# EAGLE schematic design1 (EAGLE 9.6.2)

## Sheet 1 of 2
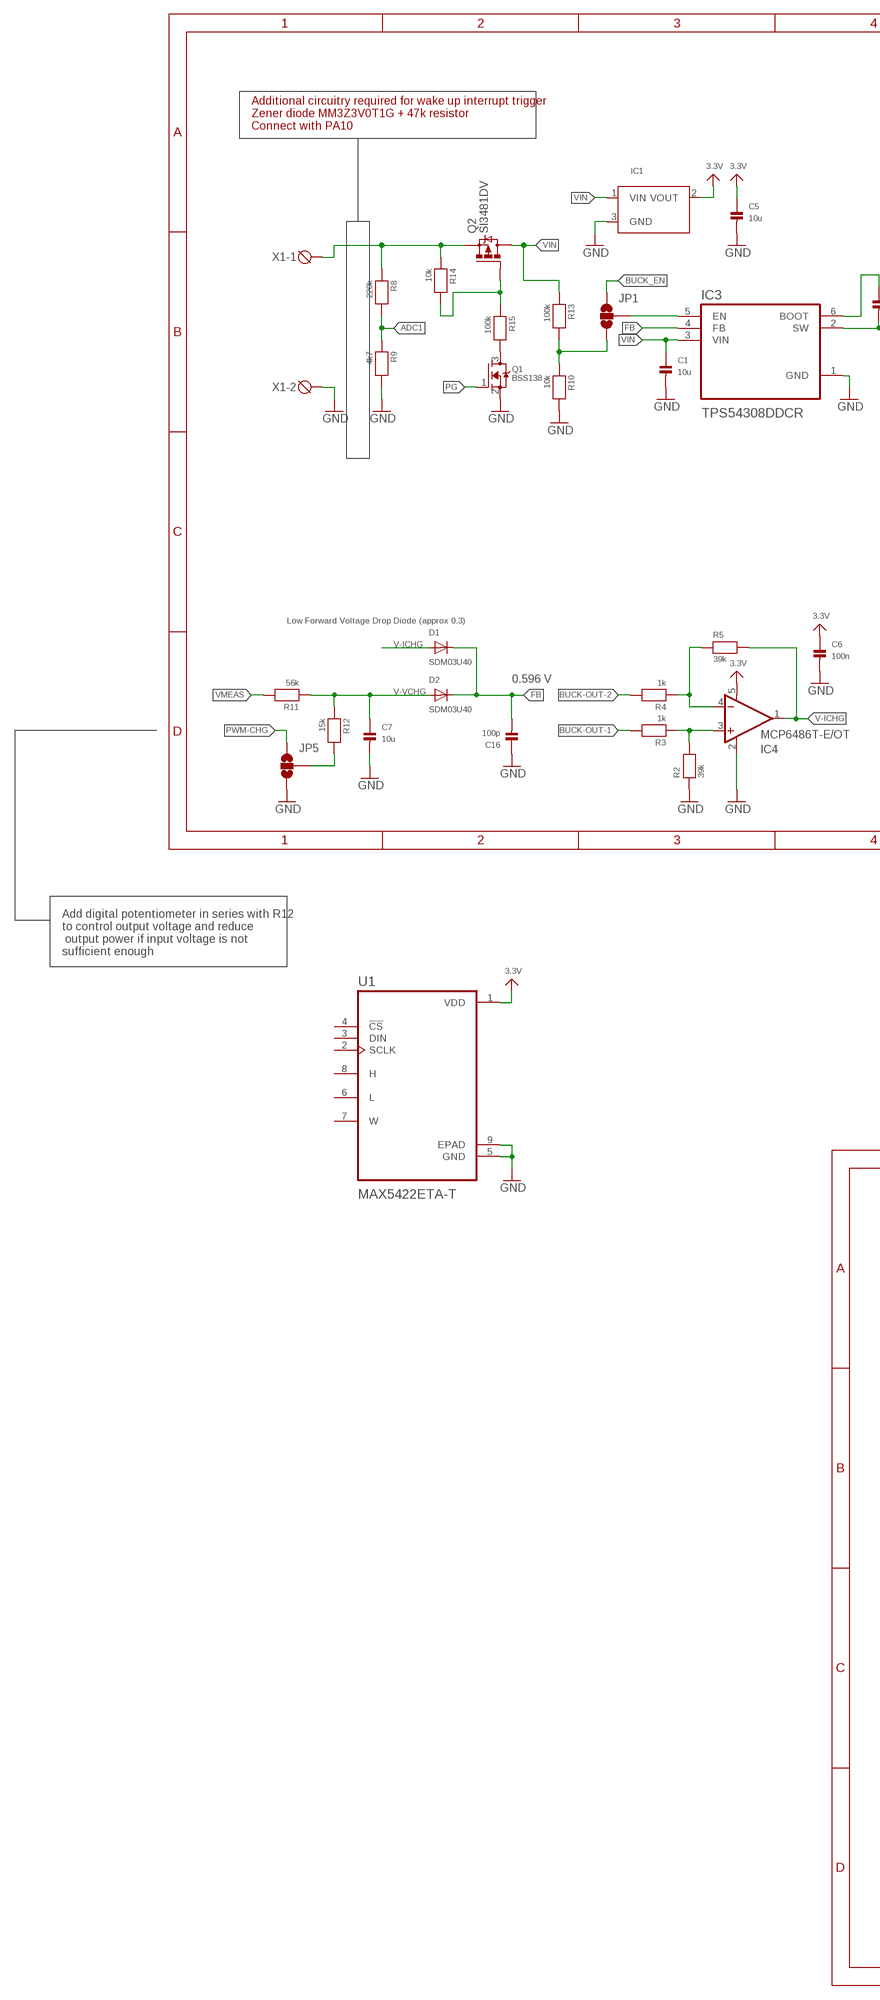
[diagram p0: schematic, sheet 1, part 1 of 2]
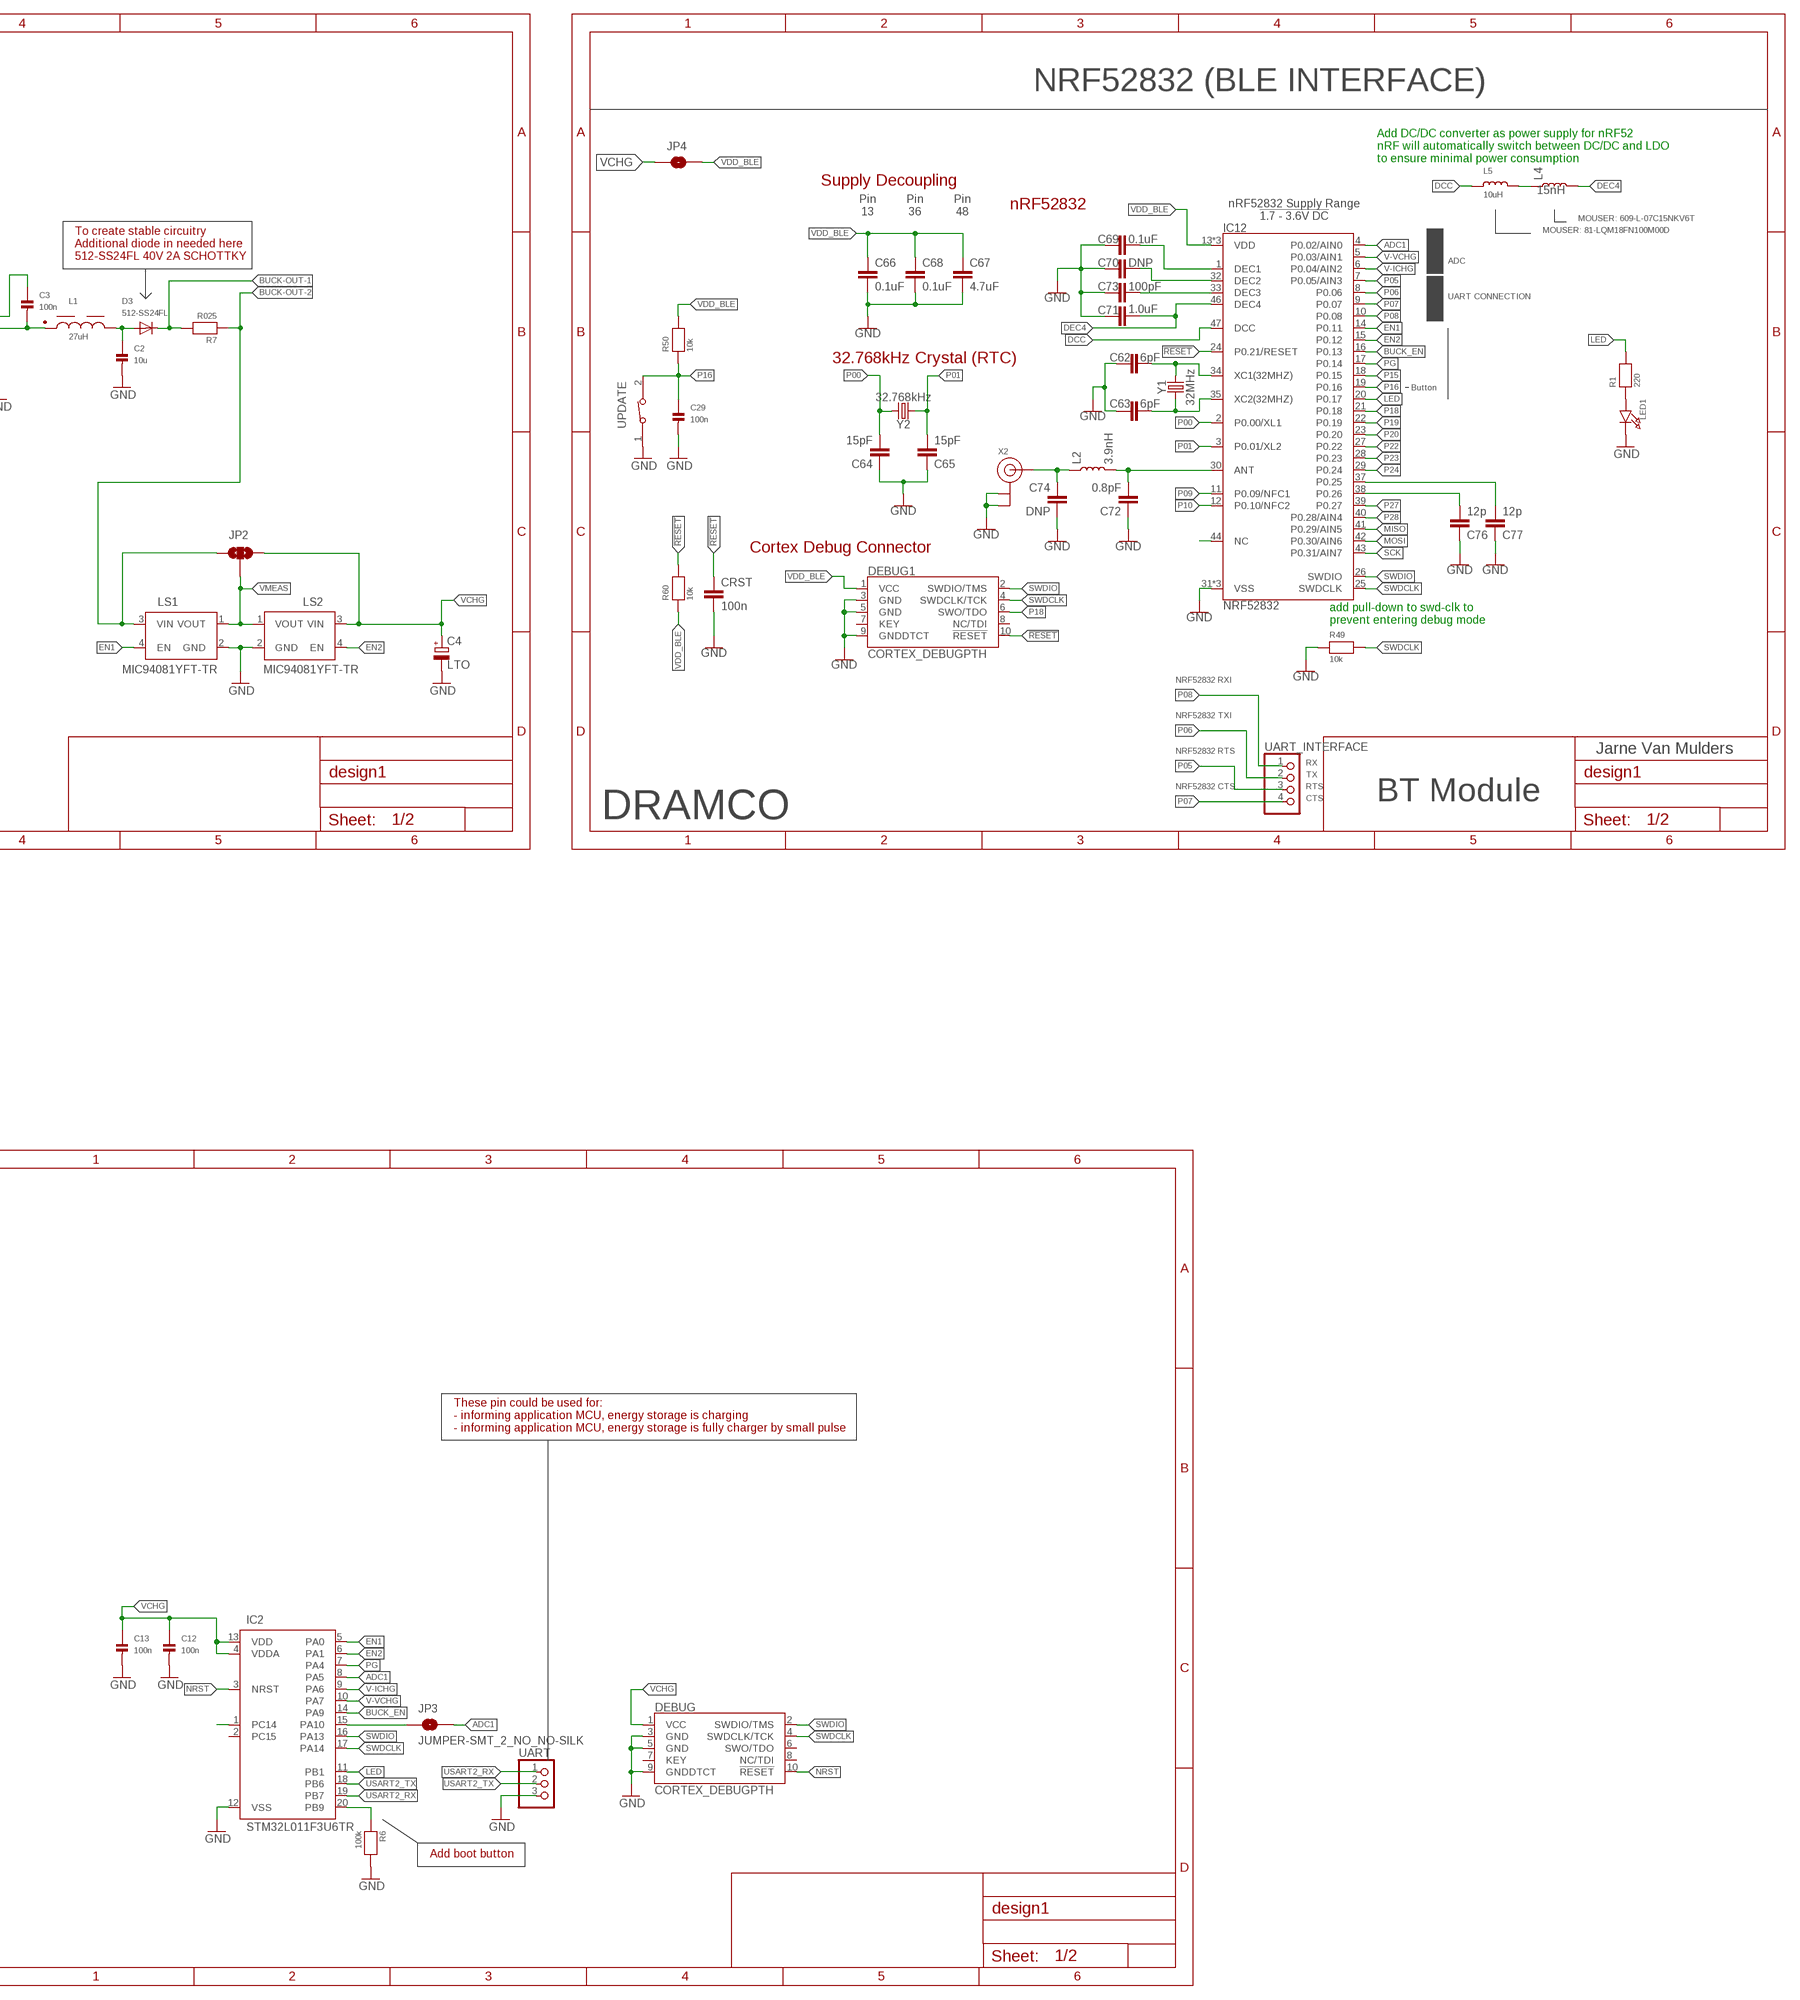
[diagram p1: schematic, sheet 1, part 2 of 2]

### Parts
C1  10u  CAP_CERAMIC0603  [0603]
C2  10u  CAP_CERAMIC0603  [0603]
C3  100n  CAP_CERAMIC0603  [0603]
C4  LTO  CPOL-EUE5-10.5  [E5-10,5]
C5  10u  CAP_CERAMIC0603  [0603]
C6  100n  CAP_CERAMIC0402  [0402]
C7  10u  CAP_CERAMIC0603  [0603]
C12  100n  CAP_CERAMIC0402  [0402]
C13  100n  CAP_CERAMIC0402  [0402]
C16  100p  CAP_CERAMIC0603  [0603]
C29  100n  CAP_CERAMIC0603  [0603]
C62  6pF  6PF-0402-50V-0.5%  [0402]
C63  6pF  6PF-0402-50V-0.5%  [0402]
C64  15pF  15PF-0402-50V-5%  [0402]
C65  15pF  15PF-0402-50V-5%  [0402]
C66  0.1uF  0.1UF-0402-16V-10%  [0402]
C67  4.7uF  4.7UF0603  [0603]
C68  0.1uF  0.1UF-0402-16V-10%  [0402]
C69  0.1uF  0.1UF-0402-16V-10%  [0402]
C70  DNP  CAP0402  [0402]
C71  1.0uF  1.0UF-0402-16V-10%  [0402]
C72  0.8pF  0.8PF-0402-50V-0.1PF  [0402]
C73  100pF  100PF-0402-50V-5%  [0402]
C74  DNP  CAP0402  [0402]
C76  12p  15PF-0402-50V-5%  [0402]
C77  12p  15PF-0402-50V-5%  [0402]
CRST  100n  C-EUC0603  [C0603]
D1  SDM03U40  DIODESOD-523  [SOD-523]
D2  SDM03U40  DIODESOD-523  [SOD-523]
D3  512-SS24FL  DIODESOD-123  [SOD-123]
DEBUG  CORTEX_DEBUGPTH  [2X5-PTH-1.27MM]
DEBUG1  CORTEX_DEBUGPTH  [2X5-PTH-1.27MM]
IC1  VREG_SOT23  [SOT23-R]
IC2  STM32L011F3U6TR  [QFN50P300X300X60-21N]
IC3  TPS54308DDCR  [SOT95P280X110-6N]
IC4  MCP6486T-E/OT  MCP6291T-E/OT  [SOT23-5]
IC12  NRF52832  [QFN48-6X6MM]
JP1  JUMPER-SMT_3_NO_NO-SILK  [SMT-JUMPER_3_NO_NO-SILK]
JP2  JUMPER-SMT_3_NO_NO-SILK  [SMT-JUMPER_3_NO_NO-SILK]
JP3  JUMPER-SMT_2_NO_NO-SILK  [SMT-JUMPER_2_NO_NO-SILK]
JP4  JUMPER-SMT_2_NO_NO-SILK  [SMT-JUMPER_2_NO_NO-SILK]
JP5  JUMPER-SMT_3_NO_NO-SILK  [SMT-JUMPER_3_NO_NO-SILK]
L1  27uH  WE-PD_7332_PLASTIC_7447789127  [WE-PD_7332/7345_PLASTIC_BASE]
L2  3.9nH  INDUCTOR-0402-3.9NH  [0402]
L4  15nH  INDUCTOR-0402-3.9NH  [0402]
L5  10uH  INDUCTOR_0603MP  [_0603MP]
LED1  LED0805  [CHIPLED_0805]
LS1  MIC94081YFT-TR  [IC_MIC94081YFT-TR]
LS2  MIC94081YFT-TR  [IC_MIC94081YFT-TR]
Q1  BSS138  MOSFET-NREFLOW  [SOT23-R]
Q2  SI3481DV  [TSOP-6.PAC]
R1  220  RESISTOR0603  [0603]
R2  39k  RESISTOR0603  [0603]
R3  1k  RESISTOR0603  [0603]
R4  1k  RESISTOR0603  [0603]
R5  39k  RESISTOR0603  [0603]
R6  100k  RESISTOR0603  [0603]
R7  R025  RESISTOR0603  [0603]
R8  220k  RESISTOR0603  [0603]
R9  4k7  RESISTOR0603  [0603]
R10  10k  RESISTOR0603  [0603]
R11  56k  RESISTOR0603  [0603]
R12  15k  RESISTOR0603  [0603]
R13  100k  RESISTOR0603  [0603]
R14  10k  RESISTOR0603  [0603]
R15  100k  RESISTOR0603  [0603]
R49  10k  RESISTOR0603  [0603]
R50  10k  RESISTOR0603  [0603]
R60  10k  RESISTOR0603  [0603]
U1  MAX5422ETA-T  [SON65P300X300X80-9N]
UART  HEADER-1X3ROUND  [1X03_ROUND]
UART_INTERFACE  HEADER-1X4ROUND  [1X04_ROUND]
UPDATE  434111043826  [434111043826]
X1  DG3XX-02-5.0  [DG306-5.0-02P]
X2  ANTENNA_U.FL  [U.FL]
Y1  32MHz  CRYSTAL-32MHZ-SMD-2.0X1.6MM  [CRYSTAL-SMD-2.0X1.6MM]
Y2  32.768kHz  CRYSTAL-32.768KHZSMD-3.2X1.5  [CRYSTAL-SMD-3.2X1.5MM]

### Nets
3.3V: C5.1 C6.1 IC1.2(VOUT) IC4.5(V+) U1.1(VDD)
!RESET!: CRST.1 DEBUG1.10(!RESET) IC12.24(P0.21/RESET) R60.2
ADC1: IC2.8(PA5) IC12.4(P0.02/AIN0) JP3.2 R8.2 R9.1
ANT: C72.2 IC12.30(ANT) L2.2
BUCK-OUT-1: D3.C R3.2 R7.2
BUCK-OUT-2: JP2.1 LS1.3(VIN) R4.2 R7.1
BUCK_EN: IC2.14(PA9) IC12.16(P0.13) JP1.3
DCC: IC12.47(DCC) L5.1
DEC4: C71.2 IC12.46(DEC4) L4.2
DEC5: C69.2 IC12.1(DEC1)
DEC6: C70.2 IC12.32(DEC2)
DEC8: C73.2 IC12.33(DEC3)
EN1: IC2.5(PA0) IC12.14(P0.11) LS1.4(EN)
EN2: IC2.6(PA1) IC12.15(P0.12) LS2.4(EN)
FB: C16.2 D1.K(C) D2.K(C) IC3.4(FB)
GND: C1.2 C2.2 C4.- C5.2 C6.2 C7.2 C12.2 C13.2 C16.1 C29.2 C62.1 C63.2 C64.1 C65.1 C66.2 C67.2 C68.2 C69.1 C70.1 C71.1 C72.1 C73.1 C74.2 C76.1 C77.1 CRST.2 DEBUG1.3(GND) DEBUG1.5(GND) DEBUG1.9(GNDDTCT) DEBUG.3(GND) DEBUG.5(GND) DEBUG.9(GNDDTCT) IC1.3(GND) IC2.12(VSS) IC3.1(GND) IC4.2(V-) IC12.31(VSS) IC12.45(VSS) IC12.EP(VSS) JP5.1 LED1.C LS1.2(GND) LS2.2(GND) Q1.2(S) R2.1 R6.2 R9.2 R10.2 R49.1 U1.5(GND) U1.9(EPAD) UART.3 UPDATE.1 X1.2 X2.1(GND) X2.2(GND)
LED: IC2.11(PB1) IC12.20(P0.17) R1.2
MISO: IC12.41(P0.29/AIN5)
MOSI: IC12.42(P0.30/AIN6)
N$1: JP1.1 R10.1 R13.2
N$2: C3.1 IC3.6(BOOT)
N$3: C3.2 IC3.2(SW) L1.1
N$4: Q1.3(D) R15.2
N$5: Q2.3(G) R14.2 R15.1
N$6: JP5.2 R12.2
N$7: IC3.5(EN) JP1.2
N$8: IC4.4(-IN) R4.1 R5.1
N$9: IC4.3(+IN) R2.2 R3.1
N$10: Q2.4(S) R8.1 R14.1 X1.1
N$11: IC2.15(PA10) JP3.1
N$13: C2.1 D3.A L1.2
N$20: LED1.A R1.1
N$45: C74.1 L2.1 X2.3(SIGNAL)
N$50: C77.2 IC12.37(P0.25)
N$53: L4.1 L5.2
NC: IC12.44(NC)
NRST: DEBUG.10(!RESET) IC2.3(NRST)
P00: C64.2 IC12.2(P0.00/XL1) Y2.P$2
P01: C65.2 IC12.3(P0.01/XL2) Y2.P$1
P05: IC12.7(P0.05/AIN3) UART_INTERFACE.3
P06: IC12.8(P0.06) UART_INTERFACE.2
P07: IC12.9(P0.07) UART_INTERFACE.4
P08: IC12.10(P0.08) UART_INTERFACE.1
P09: IC12.11(P0.09/NFC1)
P10: IC12.12(P0.10/NFC2)
P15: IC12.18(P0.15)
P16: C29.1 IC12.19(P0.16) R50.1 UPDATE.2
P18: DEBUG1.6(SWO/TDO) IC12.21(P0.18)
P19: IC12.22(P0.19)
P20: IC12.23(P0.20)
P22: IC12.27(P0.22)
P23: IC12.28(P0.23)
P24: IC12.29(P0.24)
P26: C76.2 IC12.38(P0.26)
P27: IC12.39(P0.27)
P28: IC12.40(P0.28/AIN4)
PB9: IC2.20(PB9) R6.1
PG: IC2.7(PA4) IC12.17(P0.14) Q1.1(G)
PWM-CHG: JP5.3
SCK: IC12.43(P0.31/AIN7)
SWDCLK: DEBUG1.4(SWDCLK/TCK) DEBUG.4(SWDCLK/TCK) IC2.17(PA14) IC12.25(SWDCLK) R49.2
SWDIO: DEBUG1.2(SWDIO/TMS) DEBUG.2(SWDIO/TMS) IC2.16(PA13) IC12.26(SWDIO)
USART2_RX: IC2.19(PB7) UART.1
USART2_TX: IC2.18(PB6) UART.2
V-ICHG: D1.A IC2.9(PA6) IC4.1(OUT) IC12.6(P0.04/AIN2) R5.2
V-VCHG: C7.1 D2.A IC2.10(PA7) IC12.5(P0.03/AIN1) R11.1 R12.1
VCHG: C4.+ C12.1 C13.1 DEBUG.1(VCC) IC2.4(VDDA) IC2.13(VDD) JP2.3 JP4.1 LS2.3(VIN)
VDD-AUX-EN: IC2.1(PC14)
VDD_BLE: C66.1 C67.1 C68.1 DEBUG1.1(VCC) IC12.13(VDD) IC12.36(VDD) IC12.48(VDD) JP4.2 R50.2 R60.1
VIN: C1.1 IC1.1(VIN) IC3.3(VIN) Q2.1(D) Q2.2(D) Q2.5(D) Q2.6(D) R13.1
VMEAS: JP2.2 LS1.1(VOUT) LS2.1(VOUT) R11.2
XC1: C62.2 IC12.34(XC1(32MHZ)) Y1.3
XC2: C63.1 IC12.35(XC2(32MHZ)) Y1.1
Unconnected: DEBUG1.7(KEY) DEBUG1.8(NC/TDI) DEBUG.6(SWO/TDO) DEBUG.7(KEY) DEBUG.8(NC/TDI) IC2.2(PC15) U1.2(SCLK) U1.3(DIN) U1.4(!CS) U1.6(L) U1.7(W) U1.8(H)

### Notes on the sheet
- NRF52832 (BLE INTERFACE)
- Additional circuitry required for wake up interrupt trigger
  Zener diode MM3Z3V0T1G + 47k resistor
  Connect with PA10
- Add DC/DC converter as power supply for nRF52
  nRF will automatically switch between DC/DC and LDO
  to ensure minimal power consumption
- Supply Decoupling
- nRF52832
- nRF52832 Supply Range
  !1.7 - 3.6V DC!
- Pin
  13
- Pin
  36
- Pin
  48
- MOUSER: 609-L-07C15NKV6T
- MOUSER: 81-LQM18FN100M00D
- To create stable circuitry
  Additional diode in needed here
  512-SS24FL 40V 2A SCHOTTKY
- ADC
- UART CONNECTION
- 32.768kHz Crystal (RTC)
- Button
- Cortex Debug Connector
- Low Forward Voltage Drop Diode (approx 0.3)
- add pull-down to swd-clk to 
  prevent entering debug mode
- 0.596 V | NRF52832 RXI
- NRF52832 TXI
- NRF52832 RTS | Jarne Van Mulders
- RX
- TX
- NRF52832 CTS | RTS
- CTS | BT Module
- DRAMCO
- Add digital potentiometer in series with R12 
  to control output voltage and reduce
   output power if input voltage is not 
  sufficient enough
- These pin could be used for:
  - informing application MCU, energy storage is charging
  - informing application MCU, energy storage is fully charger by small pulse
- Add boot button

## Sheet 2 of 2

## Library data of the parts
C1-C3 C5-C7 C12 C13 C16 C29 = microbuilder:CAP_CERAMIC: Ceramic Capacitors 0402 - 0402 Surface Mount Capacitors 16pF 50V 5% [Digikey: 445-4899-2-ND] 18pF 50V 5% [Digikey: 490-1281-2-ND] 22pF 50V 5% [Digikey: 490-1283-2-ND] 68pF 50V 5% [Digikey: 490-1289-2-ND] 0.1uF 10V 10% [Digikey: 490-1318-2-ND] 1.0uF 6.3V 10% [Digikey: 490-1320-2-ND] 0603 - 0603 Surface Mount Capacitors 16 pF 50V 5% [Digikey: 445-5051-2-ND] 22 pF 50V [Digikey: PCC220ACVTR-ND] 33 pF 50V 5% [Digikey: 490-1415-1-ND] 56pF 50V 5% [Digikey: 490-1421-1-ND] 220pF 50V 5% [Digikey: 445-1285-1-ND] 680 pF 50V 2200 pF 50V 5% C0G [Digikey: 445-1297-1-ND] 5600 pF 100V 5% X7R [Digikey: 478-3711-1-ND] 0.1 µF 25V 10% [Digikey: PCC2277TR-ND] 0.22 µF 16V 10% X7R [Digikey: 445-1318-1-ND] 1.0 µF 25V 10% [Digikey: 445-5146-2-ND] 0603 - RF Specific 3pF 250V +/-0.1pF RF [Digikey: 712-1347-1-ND] 18 pF 250V 5% [Digikey: 478-3505-1-ND or 712-1322-1-ND] 56 pF 250V 5% C0G RF [Digikey: 490-4867-1-ND] 68 pF 250V RF [Digikey: 490-4868-1-ND] 0805 - 0805 Surface Mount Capacitors 220 pF 250V 2% RF Ceramic Capacitor [Digikey: 712-1398-1-ND] 1000 pF 50V 2% NP0 Ceramic Capacitor [Digikey: 478-3760-1-ND] 0.1 µF 25V 10% Ceramic Capacitor [Digikey: PCC1828TR-ND] 1.0 µF 16V 10% Ceramic Capacitor[Digikey: 490-1691-2-ND] 10.0 µF 10V 10% Ceramic Capacitor[Digikey: 709-1228-1-ND] 10.0 uF 16V 10% Ceramic Capacitor [Digikey: 478-5165-2-ND] 47 uF 6.3V 20% Ceramic Capacitor [Digikey: 587-1779-1-ND or 399-5506-1-ND] 1206 - 1206 Surface Mount Capacitors 47uF 10V 20% Ceramic Capacitor [Digikey: 490-5528-1-ND or 399-5508-1-ND or 445-6010-1-ND] 100uF 6.3V -20%, +80% Y5V Ceramic Capacitor (Digikey: 490-4512-1-ND, Mouser: 81-GRM31CF50J107ZE1L)
C4 = rcl:CPOL-EU: POLARIZED CAPACITOR, European symbol
C62 C63 = nrf52832-breakout-temp:6PF: 15pF ceramic capacitors A capacitor is a passive two-terminal electrical component used to store electrical energy temporarily in an electric field.; PROD_ID: CAP-13455
C64 C65 = SparkFun-Capacitors:15PF: 15pF ceramic capacitors A capacitor is a passive two-terminal electrical component used to store electrical energy temporarily in an electric field.; PROD_ID: CAP-13063
C66 C68 C69 = SparkFun-Capacitors:0.1UF: 0.1µF ceramic capacitors A capacitor is a passive two-terminal electrical component used to store electrical energy temporarily in an electric field.; PROD_ID: CAP-12416
C67 = SparkFun-Capacitors:4.7UF: 4.7µF ceramic capacitors A capacitor is a passive two-terminal electrical component used to store electrical energy temporarily in an electric field.; PROD_ID: CAP-08280
C70 C74 = SparkFun-Passives:CAP: Capacitor Standard 0603 ceramic capacitor, and 0.1" leaded capacitor.
C71 = SparkFun-Capacitors:1.0UF: 1µF ceramic capacitors A capacitor is a passive two-terminal electrical component used to store electrical energy temporarily in an electric field.; PROD_ID: CAP-12417
C72 = nrf52832-breakout-temp:0.8PF: 0.8pF ceramic capacitors A capacitor is a passive two-terminal electrical component used to store electrical energy temporarily in an electric field.; PROD_ID: CAP-13456
C73 = nrf52832-breakout-temp:100PF: 100pF/0.1nF ceramic capacitors A capacitor is a passive two-terminal electrical component used to store electrical energy temporarily in an electric field.; PROD_ID: CAP-13458
C76 C77 = SparkFun-Capacitors:15PF: 15pF ceramic capacitors A capacitor is a passive two-terminal electrical component used to store electrical energy temporarily in an electric field.; PROD_ID: CAP-13063; VALUE: 15pF
CRST = rcl:C-EU: CAPACITOR, European symbol; SPICEPREFIX: C
D1-D3 = microbuilder:DIODE: Diode SMA Model Volts Amps Type Vf Vr Digikey # Notes SSA34-E3 40V 3A Schottky 480mV @ 3A 200uA @ 40V SSA34-E3/61TGITR-ND CDBA120-G 20V 1A Schottky 500mV @ 1A 500uA @ 20V 641-1014-6-ND REEL MBRA210 10V 2A Schottky 350mV @ 2A 700uA @ 10V MBRA210LT3 SOD-123 Model Volts Amps Type Vf Vr Order # Notes BAT54T1G 30V 200mA Schottky 800mV @ 200mA 2uA @ 25V BAT54T1GOSTR-ND B0530W 30V 500mA Schottky 430mV @ 500mA 130uA @ 30V B0530W-FDICT-ND REEL MBR120 1A 20V Schottky 340mV @ 1A MBR120VLSFT1GOSCT-ND SOD-323 Model Volts Amps Type Vf Vr Order # Notes PMEG2005EJ 20V 500mA Schottky 355mV @ 500mA 568-4110-1-ND ZLLS410 10V 570mA Schottky 380mV @ 570mA ZLLS410CT-ND 1N4148WS 75V 150mA Silicon/Simple 1V 1N4148WSFSCT-ND REEL SOD-523 Model Volts Amps Type Vf Vr Order # Notes BAT54XV2 30V 200mA Schottky 0.8V @ 100mA BAT54XV2CT-ND TB751S 30V 30mA Schottky RB751S-40TE61CT-ND SOT23-R/W (R = Solder Paste/Reflow Ovens, W = Hand-Soldering) Model Volts Amps Type Vf Vr Order # Notes BAT54FILM 40V 300mA Schottky 497-7162-1-ND
DEBUG DEBUG1 = SparkFun-Connectors:CORTEX_DEBUG: Cortex Debug Connector Datasheet <http://infocenter.arm.com/help/topic/com.arm.doc.faqs/attached/13634/cortex_debug_connectors.pdf>
IC1 = microbuilder:VREG_SOT23: SOT23 Fixed Voltage Regulators Part Current Out V Out V In V Dropout Digikey Part No. AP7313 150mA 3.3V 3.5-6V 0.15V @ 150mA AP7313-33SAG-7DICT-ND
IC2 = STM32L011F3U6TR:STM32L011F3U6TR: UFQFPN20; A_MAX: 0.6; B_MAX: 0.3; B_MIN: 0.18; B_NOM: 0.25; D2_NOM: 1.5; D_MAX: 3.1; D_MIN: 2.9; D_NOM: 3.0; E2_NOM: 1.5; ENOM: 0.5; E_MAX: 3.1; E_MIN: 2.9; E_NOM: 3.0; L_MAX: 0.23; L_MIN: 0.13; L_NOM: 0.35; MANUFACTURER: STMicroelectronics; PIN_COUNT_D: 5.0; PIN_COUNT_E: 5.0; SNAPEDA_PACKAGE_ID: 23449; STANDARD: IPC 7351B
IC3 = TPS54308DDCR:TPS54308DDCR: Check availability <https://pricing.snapeda.com/parts/TPS54308DDCR/Texas%20Instruments/view-part?ref=eda>; AVAILABILITY: In Stock; DESCRIPTION: 4.5-V to 28-V Input, 3-A output, synchronous 350-kHz FCCM step-down converter; MF: Texas Instruments; MP: TPS54308DDCR; PACKAGE: SOT-23-THN-6 Texas Instruments; PRICE: None; PURCHASE-URL: https://pricing.snapeda.com/search/part/TPS54308DDCR/?ref=eda
IC4 = SparkFun-Retired:MCP6291: Rail to rail OpAmp with 10MHz GBP Prototype: IC-11991; PROD_ID: IC-11991; VALUE: MCP6291T
IC12 = SparkFun-RF:NRF52832: Nordic nRF52832 Bluetooth Smart/ANT/2.4GHz RF SoC The nRF52832 SoC is a powerful, highly flexible ultra-low power multiprotocol SoC ideally suited for Bluetooth® Smart ANT and 2.4GHz ultra low-power wireless applications. The nRF52832 SoC is built around a 32-bit ARM® Cortex™-M4F CPU with 512kB + 64kB RAM. The embedded 2.4GHz transceiver supports Bluetooth Smart, ANT and proprietary 2.4 GHz protocol stack. It is on air compatible with the nRF51 Series, nRF24L and nRF24AP Series products from Nordic Semiconductor. Datasheet <https://cdn.sparkfun.com/datasheets/Wireless/Bluetooth/nRF52832_PS_v1.0.pdf> SparkFun Products: SparkFun nRF52832 Breakout <https://www.sparkfun.com/products/13990>; PROD_ID: IC-13460
JP1 JP2 JP5 = SparkFun-Jumpers:JUMPER-SMT_3_NO: Normally open jumper This jumper has three pads in close proximity to each other. Apply solder to close the connection(s).
JP3 JP4 = SparkFun-Jumpers:JUMPER-SMT_2_NO: Normally open jumper This jumper has two pads in close proximity to each other. Apply solder to close the connection. Round pads are easier to solder for beginners, but are a lot larger. SparkFun Product that uses the round pads: SparkFun EL Sequencer <https://www.sparkfun.com/products/12781>
L1 = EMCComponents (rev19b):WE-PD_7332_PLASTIC: SMD Shielded Power Inductor Characteristics Magnetically shielded version which results in a low leakage field High Saturation currents up to 25 A Very low self-losses at high switching frequency‘s Wide inductances spectrum available at all sizes Operating temperature: –40 °C to +125 °C Applications Perfectly suitable for switching regulators with extremely high efficiency Integrated DC/DC- converter Switching regulators with low operating voltages (Graphic cards, embedded PC-Cards, Mainboards) Plastic base: Because of the one piece construction these are more suitable for high vibration or shock applications <http://katalog.we-online.de/media/images/v2/Family_WE-PD.jpg> Details see: http://katalog.we-online.de/en/pbs/WE-PD? Updated by Dan Xu 2014-07-08 2014 (C) Wurth Elektronik; WE-NUMBER: 7447789127/27uH
L2 = nrf52832-breakout-temp:INDUCTOR: Inductors; PROD_ID: NDUC-13457
L4 = nrf52832-breakout-temp:INDUCTOR: Inductors; PROD_ID: NDUC-13457; VALUE: 3.9nH
L5 = microbuilder:INDUCTOR: Inductors
LED1 = microbuilder:LED: LED 0603 - 0603 Surface Mount Package 2mA: Green LED - Low Power (3.9mcd, 2ma, 1.7Vf) - Digikey: 475-2709-2-ND Orange LED - Low Power (9.8mcd, 2ma, 1.8Vf) - Digikey: 475-1194-2-ND Red LED - Low Power (5mcd, 2ma, 1.8Vf) - Digikey: 475-1195-2-ND Yellow LED - Low Power (7mcd, 2ma, 1.8Vf) - Digikey: 475-1196-2-ND 5mA: Blue LED - Low Power (17mcd, 5ma, 2.9Vf) - Digikey: LNJ937W8CRACT-ND 0805 - 0805 Surface Mount Package 2mA: Red LED (8.8mcd, 2mA, 1.8Vf, Clear) - Low Power [Digikey: 475-2510-1-ND] Green LED (5mcd, 2mA, 1.8Vf, Clear) - Low Power [Digikey: 475-2730-1-ND] Yellow LED (11.3mcd, 2mA, 1.8Vf, Clear) - Low Power [Digikey: 475-2555-1-ND] 20mA: Red LED (104mcd, 20mA, Diffused) - LS R976 [Digikey: 475-1278-6-ND] Red LED (12mcd, 20mA, 2.0Vf, Clear) - APT2012EC [Digikey: 754-1128-1-ND] Green LED (15mcd, 20mA, 2.2Vf, Clear) - APT2012GC [Digikey: 754-1131-1-ND] Orange LED (160mcd, 20mA, 2.1Vf, Clear) - APT2012SECK [Digikey: 754-1130-1-ND] 1206 - 1206 Surface Mount Package Green LED (26mcd, 20mA, Diffused) - LG N971 [Digikey: 475-1407-6-ND] Red LED (15mcd, 20mA, Diffused) - LH N974 [Digikey: 475-1416-6-ND]
LS1 LS2 = MIC94081YFT-TR:MIC94081YFT-TR: Power Switch/Driver 1:1 P-Channel 2A 4-TMLF® (0.85x0.85) Check prices <https://pricing.snapeda.com/parts/MIC94081YFT-TR/Microchip/view-part?ref=eda>; AVAILABILITY: In Stock; DESCRIPTION: Power Switch/Driver 1:1 P-Channel 2A 4-TMLF® (0.85x0.85); MF: Microchip; MP: MIC94081YFT-TR; PACKAGE: UFDFN-4 Microchip; PRICE: None
Q1 = microbuilder:MOSFET-N: N-Channel Mosfet LEGEND VDS: Voltage Drain-Source ID: Drain Current RDS(ON): Drain-Source On-State Resistance VGS(TH): Gate-Source Threshold Voltage CISS: Drain-Source Input Capacitance SOT-23 Name VDS ID RDS(ON) VGS(TH) CISS Order Number 2N7002E 60V 260mA 2.5 Ohm 2.5V @ 250uA 26.7pF @ 25V 2N7002ET1GOSTR-ND BSH103 30V 850mA 400 mOhm 400mV @ 1mA 83pF @ 24V BSH103,235-ND BSS138 60V 320mA 1.6 Ohm 1.5V @ 250uA 50pF @ 10V Mouser: 771-BSS138PW115 DMN2075U-7 20V 4.2A 38 mOhm 1V @ 250 uA 594.3pF @ 10V DMN2075U-7DICT-ND * BSS138 good choice for I2C level-shifting
Q2 = transistor-power:SI3481DV: P-Channel 30-V (D-S) MOSFET Source: http://www.vishay.com/docs/72105/72105.pdf
R1-R15 R49 R50 R60 = microbuilder:RESISTOR: Resistors 0402 - 0402 Surface Mount Package 22 Ohm 1% 1/16W [Digikey: 311-22.0LRTR-ND] 33 Ohm 5% 1/16W 1.0K 5% 1/16W 1.5K 5% 1/16W 2.0K 1% 1/16W 10.0K 1% 1/16W [Digikey: 311-10.0KLRTR-ND] 10.0K 5% 1/16W [Digikey: RMCF0402JT10K0TR-ND] 12.1K 1% 1/16W [Digikey: 311-22.0LRTR-ND] 100.0K 5% 1/16W 0603 - 0603 Surface Mount Package 0 Ohm 1/10 Watt 1% Resistor 15 Ohm 1/10 Watt 1% Resistor 33 Ohm 1/10 Watt 1% Resistor 49.9 Ohm 1/10 Watt 1% Resistor 100 Ohm 1/10 Watt 1% Resistor 150 Ohm 1/10 Watt 1% Resistor 240 Ohm 1/10 Watt 1% Resistor 390 Ohm 1/10 Watt 1% Resistor 560 Ohm 1/10 Watt 1% Resistor 680 Ohm 1/10 Watt 1% Resistor 750 Ohm 1/10 Watt 1% Resistor 1.0K Ohm 1/10 Watt 1% Resistor 1.5K Ohm 1/10 Watt 1% Resistor 2.0K Ohm 1/10 Watt 1% Resistor 2.2K Ohm 1/10 Watt 1% Resistor 3.3K Ohm 1/10 Watt 1% Resistor 4.7K Ohm 1/10 Watt 1% Resistor 10.0K Ohm 1/10 Watt 1% Resistor 12.0K Ohm 1/10 Watt 1% Resistor 12.1K Ohm 1/10 Watt 1% Resistor 20.0K Ohm 1/10 Watt 1% Resistor 33.0K Ohm 1/10 Watt 1% Resistor 100.0K Ohm 1/10 Watt 1% Resistor 0805 - 0805 Surface Mount Package 0 Ohm 1/8 Watt 1% Resistor 33 Ohm 1/8 Watt 1% Resistor 100 Ohm 1/8 Watt 1% Resistor 150 Ohm 1/8 Watt 1% Resistor 200 Ohm 1/8 Watt 1% Resistor 240 Ohm 1/8 Watt 1% Resistor 330 Ohm 1/8 Watt 1% Resistor 390 Ohm 1/8 Watt 1% Resistor 470 Ohm 1/8 Watt 1% Resistor 1.0K Ohm 1/8 Watt 1% Resistor 1.5K Ohm 1/8 Watt 1% Resistor 2.0K Ohm 1/8 Watt 1% Resistor 4.7K Ohm 1/8 Watt 1% Resistor 5.1K Ohm 1/8 Watt 1% Resistor 5.6K Ohm 1/8 Watt 1% Resistor 10.0K Ohm 1/8 Watt 1% Resistor 22.0K Ohm 1/8 Watt 1% Resistor 33.0K Ohm 1/8 Watt 1% Resistor 100K Ohm 1/8 Watt 1% Resistor 1206 - 1206 Surface Mount Package 2012 - 2010 Surface Mount Package 0.11 Ohm 1/2 Watt 1% Resistor - Digikey: RHM.11UCT-ND
U1 = MAX5422ETA-T:MAX5422ETA-T: Check availability <https://pricing.snapeda.com/parts/MAX5422ETA/Analog%20Devices/view-part?ref=eda>; AVAILABILITY: In Stock; DESCRIPTION: Digital Potentiometer 50k Ohm 1 Circuit 256 Taps SPI Interface 8-TDFN-EP (3x3); MF: Analog Devices; MP: MAX5422ETA; PACKAGE: TDFN-EP-8 Maxim; PRICE: None; PURCHASE-URL: https://pricing.snapeda.com/search?q=MAX5422ETA&ref=eda
UART = microbuilder:HEADER-1X3: PIN HEADER
UART_INTERFACE = microbuilder:HEADER-1X4: PIN HEADER
UPDATE = Eagle_SWITCHES (rev18c):434111043826: 6.0x3.5 mm SMD WS-TASV <http://katalog.we-online.de/media/images/v2/Family_WS-TASV_6.0x3.jpg> Details see: http://katalog.we-online.de/em/datasheet/4341x1xxx8x6.pdf 2015 (C) Wurth Elektronik
X1 = degson:DG3XX-02: DG350-3.5-02P DG306-5.0-02P
X2 = adafruit:ANTENNA_U.FL: U.FL Antenna Connector
Y1 = nrf52832-breakout-temp:CRYSTAL-32MHZ: 32MHz Crystal Digikey Example <http://www.digikey.com/product-detail/en/murata-electronics-north-america/XRCGB32M000F2P00R0/490-9769-1-ND/4952013> Frequency: 32MHz Frequency Stability: ±20ppm Frequency Tolerance: ±20ppm Load Capacitance: 6pF; PROD_ID: XTAL-13459
Y2 = SparkFun-Clocks:CRYSTAL-32.768KHZ: 32.768kHz Crystal Frequency: 32.768kHz Frequency Stability: ±20ppm Load Capacitance: 12.5pF (PTH-2X6 & SMD-3.2X1.5), 6pF (SMD-2X6); PROD_ID: XTAL-13062